# EAGLE design Adafruit 1.54in eInk Breakout (EAGLE 9.0.1)
COMPANY: ADAFRUIT INDUSTRIES; DRAWN: K. TOWNSEND; REV: A
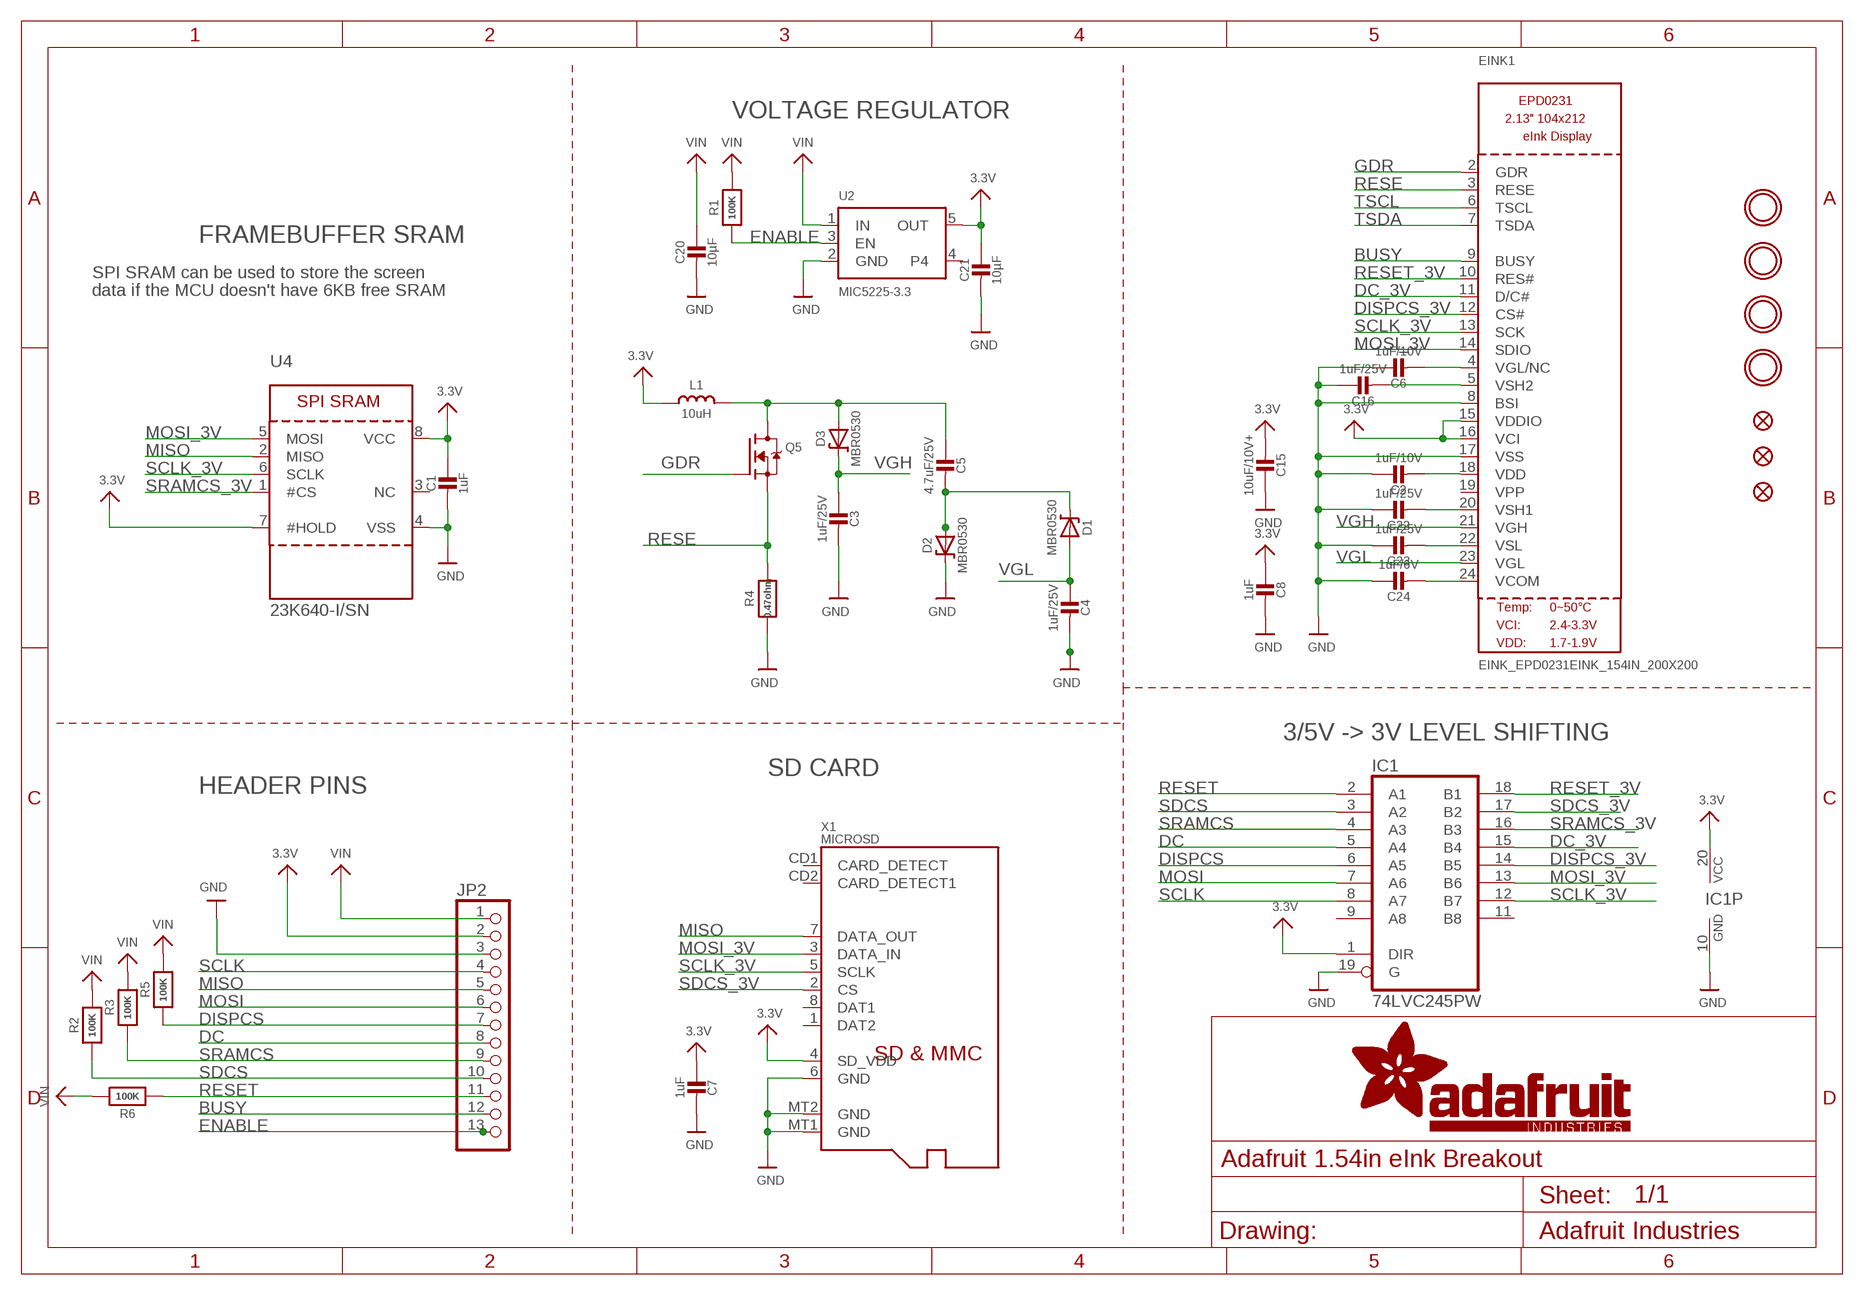
[diagram p0: schematic, sheet 1]

## Parts
C1  1uF  CAP_CERAMIC0805_10MGAP  [0805_10MGAP]
C2  1uF/10V  CAP_CERAMIC0805-NOOUTLINE  [0805-NO]
C3  1uF/25V  CAP_CERAMIC0805-NOOUTLINE  [0805-NO]
C4  1uF/25V  CAP_CERAMIC0805-NOOUTLINE  [0805-NO]
C5  4.7uF/25V  CAP_CERAMIC0805-NOOUTLINE  [0805-NO]
C6  1uF/10V  CAP_CERAMIC0805-NOOUTLINE  [0805-NO]
C7  1uF  CAP_CERAMIC0805-NOOUTLINE  [0805-NO]
C8  1uF  CAP_CERAMIC0805-NOOUTLINE  [0805-NO]
C15  10uF/10V+  CAP_CERAMIC0805-NOOUTLINE  [0805-NO]
C16  1uF/25V  CAP_CERAMIC0805-NOOUTLINE  [0805-NO]
C20  10µF  CAP_CERAMIC0805-NOOUTLINE  [0805-NO]
C21  10µF  CAP_CERAMIC0805-NOOUTLINE  [0805-NO]
C22  1uF/25V  CAP_CERAMIC0805-NOOUTLINE  [0805-NO]
C23  1uF/25V  CAP_CERAMIC0805-NOOUTLINE  [0805-NO]
C24  1uF/6V  CAP_CERAMIC0805-NOOUTLINE  [0805-NO]
D1  MBR0530  DIODE-SCHOTTKYSOD-123  [SOD-123]
D2  MBR0530  DIODE-SCHOTTKYSOD-123  [SOD-123]
D3  MBR0530  DIODE-SCHOTTKYSOD-123  [SOD-123]
EINK1  EINK_EPD0231EINK_154IN_200X200  [EINK_154IN]
FID1  FIDUCIAL_1MM  [FIDUCIAL_1MM]
FID2  FIDUCIAL_1MM  [FIDUCIAL_1MM]
FID3  FIDUCIAL_1MM  [FIDUCIAL_1MM]
IC1  74LVC245PW  74245TSSOP20  [TSSOP20]
JP2  HEADER-1X13  [1X13_ROUND_70]
L1  10uH  INDUCTORNR401  [INDUCTOR_4X4MM_NR401]
Q5  IRLML0100  IRLML2060TRPBF  [SOT23-3]
R1  100K  RESISTOR0805_NOOUTLINE  [0805-NO]
R2  100K  RESISTOR0805_NOOUTLINE  [0805-NO]
R3  100K  RESISTOR0805_NOOUTLINE  [0805-NO]
R4  0.47ohm  RESISTOR0805_10MGAP  [0805_10MGAP]
R5  100K  RESISTOR0805_NOOUTLINE  [0805-NO]
R6  100K  RESISTOR0805_NOOUTLINE  [0805-NO]
U2  MIC5225-3.3  VREG_SOT23-5  [SOT23-5]
U4  23K640-I/SN  SRAM_SPI_SOIC8  [SOIC8_150MIL]
U$3  MOUNTINGHOLE2.5  [MOUNTINGHOLE_2.5_PLATED]
U$4  MOUNTINGHOLE2.5  [MOUNTINGHOLE_2.5_PLATED]
U$5  MOUNTINGHOLE2.5  [MOUNTINGHOLE_2.5_PLATED]
U$6  MOUNTINGHOLE2.5  [MOUNTINGHOLE_2.5_PLATED]
X1  MICROSD  [MICROSD]

## Nets
3.3V: C1.1 C7.1 C8.1 C15.2 C21.1 EINK1.15(VDDIO) EINK1.16(VCI) IC1.1(DIR) IC1.20(VCC) JP2.2 L1.P$2 U2.5(OUT) U4.7(#HOLD) U4.8(VCC) X1.4(SD_VDD)
BUSY: EINK1.9(BUSY) JP2.12
DC: IC1.5(A4) JP2.8
DC_3V: EINK1.11(D/C#) IC1.15(B4)
DISPCS: IC1.6(A5) JP2.7 R5.1
DISPCS_3V: EINK1.12(CS#) IC1.14(B5)
ENABLE: JP2.13 R1.1 U2.3(EN)
GDR: EINK1.2(GDR) Q5.1(G)
GND: C1.2 C2.1 C3.2 C4.2 C6.1 C7.2 C8.2 C15.1 C16.1 C20.2 C21.2 C22.1 C23.1 C24.1 D2.C EINK1.8(BSI) EINK1.17(VSS) IC1.10(GND) IC1.19(G) JP2.3 R4.2 U2.2(GND) U4.4(VSS) X1.6(GND) X1.MT1(GND) X1.MT2(GND)
MISO: JP2.5 U4.2(MISO) X1.7(DATA_OUT)
MOSI: IC1.7(A6) JP2.6
MOSI_3V: EINK1.14(SDIO) IC1.13(B6) U4.5(MOSI) X1.3(DATA_IN)
N$2: C5.2 D1.C D2.A
N$3: C5.1 D3.A L1.P$1 Q5.3(D)
N$4: C16.2 EINK1.5(VSH2)
N$5: C2.2 EINK1.18(VDD)
N$6: C22.2 EINK1.20(VSH1)
N$9: C6.2 EINK1.4(VGL/NC)
N$27: C23.2 EINK1.22(VSL)
N$33: C24.2 EINK1.24(VCOM)
RESE: EINK1.3(RESE) Q5.2(S) R4.1
RESET: IC1.2(A1) JP2.11 R6.1
RESET_3V: EINK1.10(RES#) IC1.18(B1)
SCLK: IC1.8(A7) JP2.4
SCLK_3V: EINK1.13(SCK) IC1.12(B7) U4.6(SCLK) X1.5(SCLK)
SDCS: IC1.3(A2) JP2.10 R2.1
SDCS_3V: IC1.17(B2) X1.2(CS)
SRAMCS: IC1.4(A3) JP2.9 R3.1
SRAMCS_3V: IC1.16(B3) U4.1(#CS)
TSCL: EINK1.6(TSCL)
TSDA: EINK1.7(TSDA)
VGH: C3.1 D3.C EINK1.21(VGH)
VGL: C4.1 D1.A EINK1.23(VGL)
VIN: C20.1 JP2.1 R1.2 R2.2 R3.2 R5.2 R6.2 U2.1(IN)
Unconnected: EINK1.19(VPP) IC1.9(A8) IC1.11(B8) U2.4 U4.3(NC) X1.1(DAT2) X1.8(DAT1) X1.CD1(CARD_DETECT) X1.CD2(CARD_DETECT1)

## Notes on the sheet
- VOLTAGE REGULATOR
- FRAMEBUFFER SRAM
- SPI SRAM can be used to store the screen
- data if the MCU doesn't have 6KB free SRAM
- 3/5V -> 3V LEVEL SHIFTING
- SD CARD
- HEADER PINS

## Library data of the parts
C1-C8 C15 C16 C20-C24 = microbuilder:CAP_CERAMIC: Ceramic Capacitors For new designs, use the packages preceded by an '_' character since they are more reliable: The following footprints should be used on most boards: _0402 - Standard footprint for regular board layouts _0603 - Standard footprint for regular board layouts _0805 - Standard footprint for regular board layouts _1206 - Standard footprint for regular board layouts For extremely tight-pitch boards where space is at a premium, the following 'micro-pitch' footprints can be used (smaller pads, no silkscreen outline, etc.): _0402MP - Micro-pitch footprint for very dense/compact boards _0603MP - Micro-pitch footprint for very dense/compact boards _0805MP - Micro-pitch footprint for very dense/compact boards _1206MP - Micro-pitch footprint for very dense/compact boards
D1-D3 = microbuilder:DIODE-SCHOTTKY
EINK1 = microbuilder:EINK_EPD0231
FID1-FID3 = microbuilder:FIDUCIAL: Fiducial Alignment Points Various fiducial points for machine vision alignment.; BOM: EXCLUDE
IC1 = microbuilder:74*245: Octal BUS TRANSCEIVER, 3-state
JP2 = microbuilder:HEADER-1X13
L1 = microbuilder:INDUCTOR: Inductors 0603: 10nH Ceramic Inductor - microwire antenna/RF (Digikey: 712-1434-2-ND) 0805: 560nH Ceramic Inductor - RF (Digikey: 553-1047-1-ND) 270nH Ceramic Inductor - Q = 40@250MHz, +-5%, 1 Ohm DC Resistance (Digikey: 535-10506-2-ND) 1007 (2518 Metric) SMT: 10µH 10% 250mOhm 820mA 1007 Inductor (Digikey: 587-2189-1-ND) 22µH 10% 500mOhm 580mA 1007 Inductor (Digikey: 587-2190-1-ND) 47µH 10% 950mOhm 420mA 1007 Inductor (Digikey: 587-2191-1-ND) 47µH 5% 100mOhm 1A 1008 Inductor (Digikey: 732-1816-1-ND) 5.0x5.0mm (Taiyo Yuden NR5040 Series) 6.8µH 20% 2.3A 64mOhm Inductor (Digikey: 587-2374-2-ND) 5.0x5.0mm (TDK VLC5045 Series) 4.7µH 20% 3.3A 34mOhm Inductor (Digikey: 445-6526-1-ND) 6.8µH 20% 2.7A 46mOhm Inductor (Digikey: 445-6527-1-ND) 6.0x6.0mm (TDK VLC6045 Series) 4.7µH 20% 3.8A 27mOhm Inductor (Digikey: 445-6538-2-ND) 6.8µH 20% 3A 41mOhm Inductor (Digikey: 445-6540-1-ND) 6.2µH 30% 2.2A 45mOhm Inductor (Digikey: SRR5028-6R2YCT-ND) - Not TDK VLC6045 but footprint should match 6.0x6.0mm (TDK SLF6045 Series) 6.8uH 30% 2A 33mOhm Inductor (Digikey: 445-4572-1-ND, Mouser: 810-SLF645T6R8N2R0PF) 6.0x6.0mm (Sumida CDRH5D28 Series) 6.2uH 30% 1.8A 45mOhm Inductor (Digikey: 308-1542-1-ND) Taiyo Yuden NR3015T2R2M - 2.2uH 20% 1.5A (Digikey: 587-1648-2-ND, Mouser: 963-NR3015T2R2M) - Used with TI TPS62172 CoilCraft RFID Transponder Coil - MA5532-AE (For use with AS3935 Lightning Sensor) Taiyo Yuden NRH2412T2R2MNGH - 2.2uH 20% 1AA (Digikey: 587-3443-1-ND) - Used with TI LM3671 Vishay IHLP 1.0uH Molded Inductor - 24mOhm DCR, 5A, +/-20%, -55°C-125°C (Digikey: 541-1319-1-ND)
Q5 = Parts:IRLML2060TRPBF
R1-R6 = microbuilder:RESISTOR: Resistors For new designs, use the packages preceded by an '_' character since they are more reliable: The following footprints should be used on most boards: _0402 - Standard footprint for regular board layouts _0603 - Standard footprint for regular board layouts _0805 - Standard footprint for regular board layouts _1206 - Standard footprint for regular board layouts For extremely tight-pitch boards where space is at a premium, the following 'micro-pitch' footprints can be used (smaller pads, no silkscreen outline, etc.): _0402MP - Micro-pitch footprint for very dense/compact boards _0603MP - Micro-pitch footprint for very dense/compact boards _0805MP - Micro-pitch footprint for very dense/compact boards _1206MP - Micro-pitch footprint for very dense/compact boards
U2 = microbuilder:VREG_SOT23-5: SOT23-5 Fixed Voltage Regulators Part Current Out V Out V In V Dropout θJA (°C/W) TJ (°C) Digikey Part No. ADP121 150mA 3.3V 3.4-5.5V 0.09V @ 150mA -- -- ADP121-AUJZ33R7CT-ND ADP121 150mA 3.0V 3.1-5.5V 0.09V @ 150mA -- -- ADP121-AUJZ30R7CT-ND ADP122 300mA 3.3V 3.4-5.5V 0.085V @ 300mA -- -- ADP122AUJZ-3.3-R7CT-ND ADP1712 300mA 3.3V 3.5-5.5V 0.17V @ 300mA -- -- ADP1712AUJZ-3.3-R7TR-ND AP7311 (Low Cost) 150mA 3.3V 3.5-6V 0.15V @ 150mA -- -- AP7311-33WG-7DICT-ND LD39015M18R 150mA 1.8V 1.9V-5.5V 0.08V @ 100mA -- -- 497-6977-1-ND LP2985A-33DBVR 150mA 3.3V 3.3-16V 0.28V @ 150mA 206 150 296-18479-1-ND MCP1824T-3302E/OT 300mA 3.3V 3.5V-6V 0.2V @ 300mA -- -- MCP1824T-3302E/OTCT-ND MIC5205-2.5YM5 TR 150mA 2.5V 2.7-16V 0.165V @ 150mA -- -- 576-1257-2-ND MIC5205-3.0YM5 TR 150mA 3.0V 3.2V-16V 0.165V @ 150mA -- -- 576-1258-2-ND MIC5205-3.3YM5 TR 150mA 3.3V 3.5V-16V 0.165V @ 150mA -- -- 576-1259-2-ND TPS780330220 150mA 3.3V+2.2V 3.6-5.5V 250mV Max -- -- 296-23332-1-ND TDA3663/N1,135 100mA 3.3V 3.5-45V 0.18V @ 50mA -- -- 568-5343-1-ND Max operating temp can be calculated using θJA, TJ (max junction temperature), and power in watts. Set the "Maximum Ambient Temperature" until it reaches TJ ("Max Junction Temperature"), which is the absolute limit for safe use of the regulator: Heat Sink Temperature Calculator <http://www.daycounter.com/Calculators/Heat-Sink-Temperature-Calculator.phtml> For example, With 12V source into a 3.3V LP2985 and a 30mA load, we are dissipating (12V-3.3V) * 0.03A = 0.261W. With a θJA of 206 °C/W, a TJ of 150°C, and 261mW we can safely use the chip without a heat sink up to 75°C (=147.1°C Junction Temperature).
U4 = microbuilder:SRAM_SPI_SOIC8: SRAM - 8-Pin SPI Interface 23K640-I/SN - 8KB (64Kb), 20MHz, 2.7-3.6V 23K256-I/SN - 32KB (256Kb), 20MHz, 2.7-3.6V 23LC512-I/SN - 64KB (512Kb), 20MHz, 2.7-3.6V
U$3-U$6 = microbuilder:MOUNTINGHOLE: Mounting Hole For #2 screws (0.086"/2.18mm width, 0.094"/2.4mm hole) use 2.5mm; BOM: EXCLUDE
X1 = microbuilder:MICROSD: MicroSD/Transflash Card Holder with SPI pinout 3M: 2908-05WB-MG 4UConnector: 19656 Footprint courtesy: Adafruit Industries

## Board
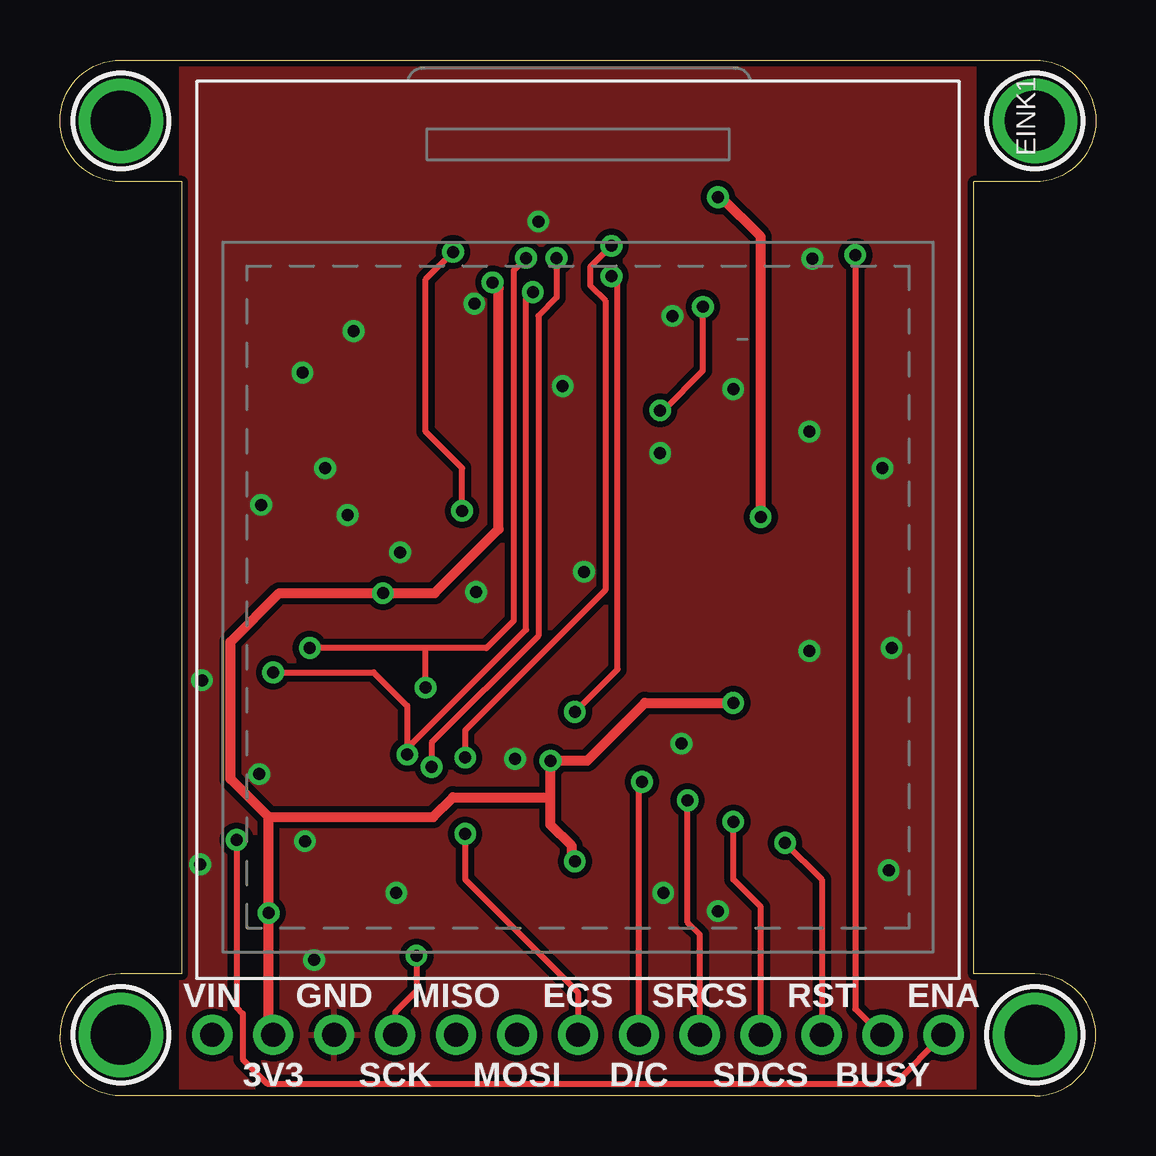
[diagram p1: board, top side]
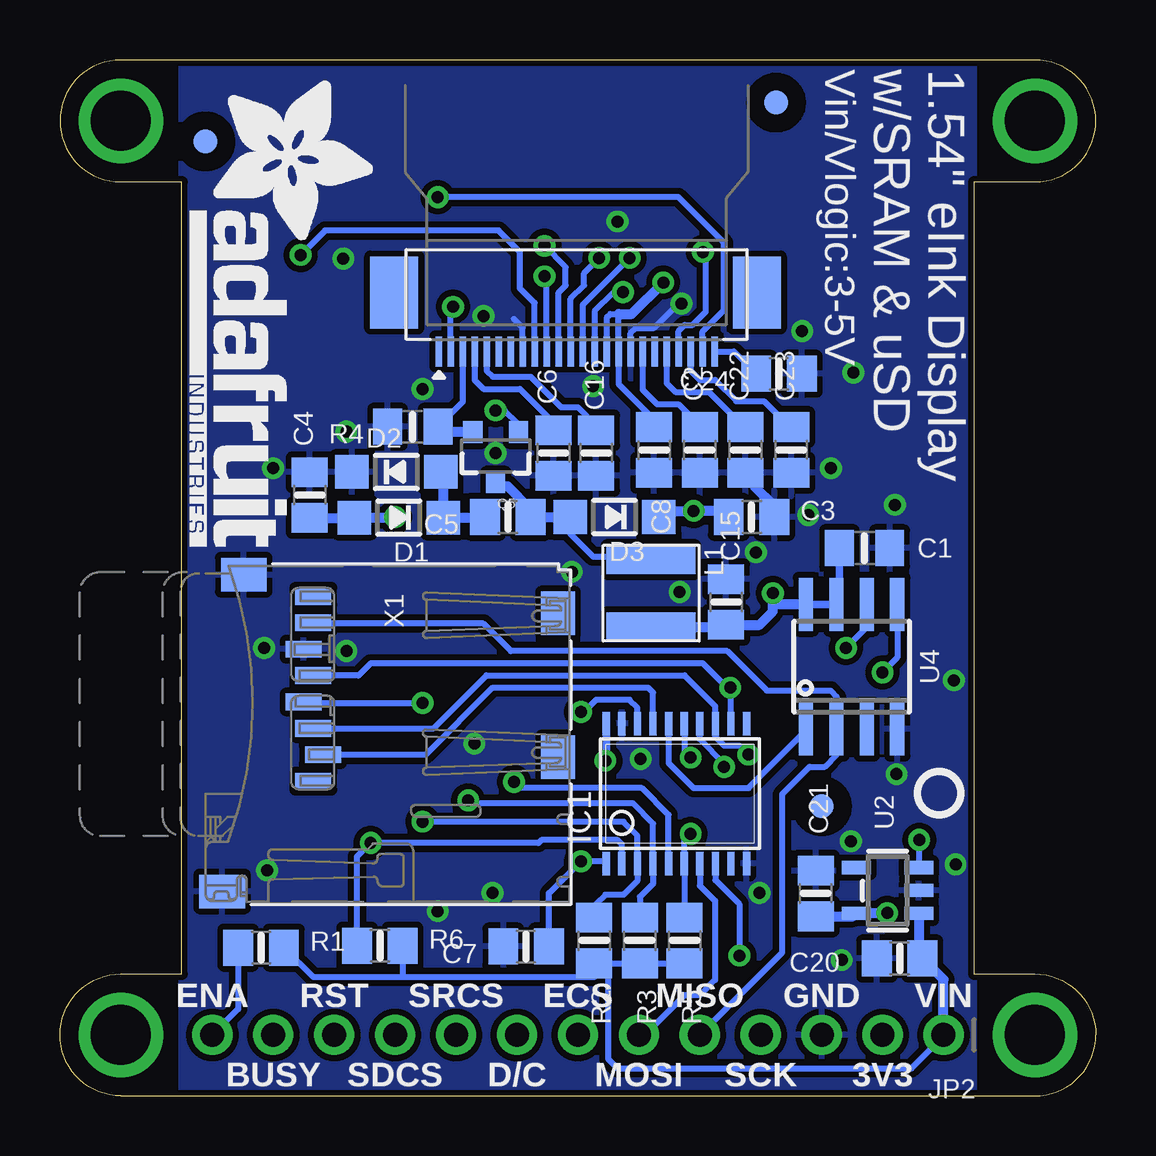
[diagram p2: board, bottom side, seen from below]

Size 43.18 x 43.18 mm. Coordinates in mm from the lower left corner, seen from the top.
Outline: 40.64,0 2.54,0 arc-90 0,2.54 arc-90 2.54,5.08 5.08,5.08 5.08,38.1 2.54,38.1 arc-90 0,40.64 arc-90 2.54,43.18 40.64,43.18 arc-90 43.18,40.64 arc-90 40.64,38.1 38.1,38.1 38.1,5.08 40.64,5.08 arc-90 43.18,2.54 arc-90 40.64,0
Copper layers (1*16): Top 0.035mm / dielectric 1.5mm / Bottom 0.035mm
Design rules "adafruit *": minimum track width 8mil, minimum drill 15.5mil, track to track 8mil, track to pad 8mil, pad to pad 8mil, via to via 8mil, smd to smd 8mil, copper to edge 10mil, drill to drill 8mil, minimum pad ring 10mil, minimum via ring 8mil, stop-mask expansion 2mil, vias tented up to drill 20mil, thermal gap 10mil

### Footprints (pad centres in the part's own frame; a part is rotated, then mirrored left to right if it is on the bottom)
0805_10MGAP = smd 1.2 x 1.5: 1 -1.05,0; 2 1.05,0
0805-NO = smd 1.24 x 1.5: 1 -0.95,0; 2 0.95,0
SOD-123 = smd 1.4 x 1.4: A 1.85,0; C -1.85,0
EINK_154IN = smd 1.25 x 0.275 bottom: 1 3.56,-8; 2 3.56,-8.5; 3 3.56,-9; 4 3.56,-9.5; 5 3.56,-10; 6 3.56,-10.5; 7 3.56,-11; 8 3.56,-11.5; 9 3.56,-12; 10 3.56,-12.5; 11 3.56,-13; 12 3.56,-13.5; 13 3.56,-14; 14 3.56,-14.5; 15 3.56,-15; 16 3.56,-15.5; 17 3.56,-16; 18 3.56,-16.5; 19 3.56,-17; 20 3.56,-17.5; 21 3.56,-18; 22 3.56,-18.5; 23 3.56,-19; 24 3.56,-19.5 | smd 3 x 2 bottom: SPRT1 1.1,-6.15; SPRT2 1.1,-21.26
FIDUCIAL_1MM = smd 1 x 1: 1 0,0
TSSOP20 = smd 0.305 x 0.991: 1 -3.075,-2.918; 2 -2.425,-2.918; 3 -1.775,-2.918; 4 -1.125,-2.918; 5 -0.475,-2.918; 6 0.175,-2.918; 7 0.825,-2.918; 8 1.475,-2.918; 9 2.125,-2.918; 10 2.775,-2.918; 11 2.775,2.918; 12 2.125,2.918; 13 1.475,2.918; 14 0.825,2.918; 15 0.175,2.918; 16 -0.475,2.918; 17 -1.125,2.918; 18 -1.775,2.918; 19 -2.425,2.918; 20 -3.075,2.918
1X13_ROUND_70 = drill 1 pad 1.676: 1 -15.24,0; 2 -12.7,0; 3 -10.16,0; 4 -7.62,0; 5 -5.08,0; 6 -2.54,0; 7 0,0; 8 2.54,0; 9 5.08,0; 10 7.62,0; 11 10.16,0; 12 12.7,0; 13 15.24,0
INDUCTOR_4X4MM_NR401 = smd 1.2 x 3.7: P$1 -1.4,0; P$2 1.4,0
SOT23-3 = smd 0.8 x 0.9: 1 -0.95,-1; 2 0.95,-1; 3 0,1.1
SOT23-5 = smd 0.55 x 1.2: 1 -0.95,-1.3; 2 0,-1.3; 3 0.95,-1.3; 4 0.95,1.3; 5 -0.95,1.3
SOIC8_150MIL = smd 0.6 x 2.2: 1 -1.905,-2.6; 2 -0.635,-2.6; 3 0.635,-2.6; 4 1.905,-2.6; 5 1.905,2.6; 6 0.635,2.6; 7 -0.635,2.6; 8 -1.905,2.6
MOUNTINGHOLE_2.5_PLATED = drill 2.5 pad 3.2: P$1 0,0
MICROSD = smd 0.7 x 1.5: 1 9,-10.64; 2 7.9,-10.24; 3 6.8,-10.64; 4 5.7,-11.04; 5 4.6,-10.64; 6 3.5,-11.04; 7 2.4,-10.64; 8 1.3,-10.64 | smd 1.8 x 1.4: CD1 2,-0.44; CD2 8,-0.44 | smd 1.4 x 1.9: MT1 0.4,-13.54; MT2 13.6,-14.44

### Placement (x,y rotation side)
C1  9.64,22.83 0 bottom
C2  16.51,26.92 90 bottom
C3  14.35,24.13 0 bottom
C4  32.77,25.04 90 bottom
C5  24.51,24.13 180 bottom
C6  22.61,26.8 90 bottom
C7  23.75,6.22 180 bottom
C8  18.41,26.92 270 bottom
C15  15.41,20.59 270 bottom
C16  20.83,26.8 90 bottom
C20  8.18,5.73 180 bottom
C21  11.67,8.43 90 bottom
C22  14.61,26.92 90 bottom
C23  12.7,26.92 90 bottom
C24  13.21,30.1 180 bottom
D1  29.06,24.1 180 bottom
D2  29.16,26.01 0 bottom
D3  20.07,24.13 180 bottom
EINK1  35.39,34.59 270 top
FID1  37.12,39.78 0 bottom
FID2  11.42,12.08 90 bottom
FID3  13.34,41.4 0 bottom
IC1  17.33,12.6 0 bottom
JP2  21.59,2.54 180 bottom
L1  18.54,20.95 270 bottom
Q5  25.02,26.67 180 bottom
R1  34.8,6.18 0 bottom
R2  20.92,6.48 270 bottom
R3  19.01,6.48 270 bottom
R4  28.47,27.89 180 bottom
R5  17.14,6.48 270 bottom
R6  29.85,6.26 0 bottom
U2  8.68,8.56 90 bottom
U4  10.18,17.89 0 bottom
U$3  2.54,2.54 0 top
U$4  40.64,2.54 0 top
U$5  2.54,40.64 0 top
U$6  40.64,40.64 0 top
U$9  [PCBFEAT-REV-040]  6.53,12.63 0 bottom
U$28  [ADAFRUIT_TEXT_20MM]  37.76,42.47 270 bottom
X1  21.98,22.12 270 bottom

### Tracks (layer width: path | path; a pad name or v marks a point on that pad's centre or on a via)
3.3V  (via drill 0.5)
  Top 0.406: 8.7,11.62 v8.7,7.62 8.7,2.73 JP2.2 | v18.03,33.91 18.29,33.66 18.29,23.62 15.62,20.95 v13.46,20.95 9.14,20.95 7.11,18.92 7.11,13.21 8.7,11.62 | v28.07,16.38 24.38,16.38 21.97,13.97 v20.45,13.97 20.45,12.45 | 20.45,12.45 20.45,11.3 21.34,10.41 21.34,9.91 v21.46,9.78 | 8.7,11.62 15.56,11.62 16.38,12.45 20.45,12.45
  Bottom 0.254: EINK1.15 20.39,32.44 20.24,32.59 19.89,32.59 EINK1.16 19.89,29.67 18.41,28.19 C8.1 | IC1.1 20.51,9.78 v21.46,9.78 22.8,8.44 C7.1 | X1.4 33.02,16.38 v28.07,16.38
  Bottom 0.305: U4.8 U4.7 10.69,20.61 C1.1 | IC1.20 20.41,13.97 v20.45,13.97
  Bottom 0.406: 18.03,33.94 v18.03,33.91 19.35,32.59 19.89,32.59 | C21.1 10.11,7.48 U2.5 9.97,7.62 v8.7,7.62 | L1.P$2 15.5,19.55 C15.2 14.02,19.64 13.46,20.19 13.46,20.45 | 13.46,20.45 v13.46,20.95 | U4.8 13.42,20.49 13.46,20.45
BUSY  (via drill 0.5)
  Top 0.254: v33.15,35.05 33.15,3.62 34.23,2.54 JP2.12
  Bottom 0.254: EINK1.9 23.39,33.05 24,33.66 24,35.18 24.89,36.07 32.13,36.07 v33.15,35.05
DC  (via drill 0.5)
  Top 0.254: JP2.8 24.13,12.95 v24.26,13.08
  Bottom 0.254: IC1.5 17.81,11.71 18.92,12.83 24,12.83 v24.26,13.08
DC_3V  (via drill 0.5)
  Top 0.254: v22.99,35.43 22.1,34.54 22.1,33.78 22.73,33.15 22.73,21.08 16.89,15.24 v16.89,14.1
  Bottom 0.254: IC1.15 17.16,14.24 17.03,14.24 v16.89,14.1 | EINK1.11 22.39,33.49 22.1,33.78 22.1,34.54 v22.99,35.43
DISPCS  (via drill 0.5)
  Top 0.254: v16.89,10.92 16.89,9.02 21.59,4.32 JP2.7
  Bottom 0.254: v16.89,10.92 17.16,10.65 IC1.6 17.14,9.67 R5.1
DISPCS_3V  (via drill 0.5)
  Top 0.254: v15.49,13.72 15.49,14.73 19.94,19.18 19.94,32.51 20.7,33.27 v20.7,34.92
  Bottom 0.254: 21,34.62 v20.7,34.92 21.34,34.29 21.34,33.78 21.89,33.23 EINK1.12 | v15.49,13.72 15.49,13.84 16.51,14.86 IC1.14
ENABLE  (via drill 0.5)
  Top 0.254: v7.37,10.67 7.37,3.68 7.62,3.43 7.62,1.52 8.64,0.51 34.8,0.51 JP2.13
  Bottom 0.254: U2.3 7.4,9.53 7.37,9.55 v7.37,10.67 | R1.1 35.75,3.62 JP2.13
GDR  (via drill 0.5)
  Top 0.254: v26.8,32.89 26.8,30.23 25.15,28.57 v25.02,28.57
  Bottom 0.254: EINK1.2 26.89,32.8 v26.8,32.89 | Q5.1 24.07,28 24.64,28.57 v25.02,28.57
GND  (via drill 0.5)
  Bottom 0.254: EINK1.17 19.39,31.79 19.18,32 18.41,32 17.4,33.02 v17.27,33.02 | EINK1.8 23.89,32.02 24.26,32.38
  Bottom 0.406: C3.2 13.4,24.58 14.22,25.4 14.22,25.78
  other vias: 34.67,18.67 8.38,24.64 19.94,36.45 25.91,14.68 34.54,9.4 31.37,34.9 12.24,31.88 8.31,13.41 11.99,24.21 5.92,17.32 5.84,9.65 18.97,14.05 14.02,8.46 14.17,22.66 10.11,30.15 11.05,26.16 20.96,29.59 31.24,27.69 34.29,26.16 28.07,29.46 25.53,32.51 21.84,21.84 10.59,5.66 10.21,10.62 31.24,18.54 27.43,7.7 25.15,8.46 25.02,26.8 17.35,21.01
  pour Bottom (isolate 0.254): 38.1,43.18 5.08,43.18 5.08,0.13 38.1,0.13
  pour Top (isolate 0.254): 38.1,43.18 5.08,43.18 5.08,0 38.1,0
MISO
  Bottom 0.254: X1.7 31.91,19.72 31.88,19.68 25.53,19.68 24.38,18.54 15.37,18.54 13.72,16.89 11.05,16.89 10.79,16.64 arc-45 10.82,16.59 U4.2 10.82,14.28 arc-45 10.79,14.22 11.3,13.72 11.94,13.72 13.08,12.57 13.08,5.97 JP2.5
MOSI
  Bottom 0.254: IC1.7 16.51,8.76 15.88,8.13 15.88,4.83 16.51,4.19 17.14,4.19 18.8,2.54 JP2.6
MOSI_3V  (via drill 0.5)
  Top 0.254: 14.48,14.48 19.43,19.43 19.43,33.22 v19.71,33.5 | 14.48,14.48 v14.48,14.22 | v8.89,17.65 13.08,17.65 14.48,16.26 14.48,14.48
  Bottom 0.254: v14.48,14.22 14.86,14.61 15.49,14.61 15.86,14.97 IC1.13 15.86,16.24 17.14,17.53 25.4,17.53 27.61,15.32 X1.3 | EINK1.14 20.89,32.7 20.09,33.5 v19.71,33.5 | U4.5 8.28,18.27 v8.89,17.65
N$2
  Bottom 0.406: D2.A 27.21,26.01 D1.C 25.46,24.11 C5.2
N$3
  Bottom 0.254: D3.A 21.92,23.44 20.96,22.48 18.67,22.48 L1.P$1
  Bottom 0.406: 21.79,24.13 D3.A C5.1 23.56,24.45 24.51,25.4 24.85,25.4 Q5.3
N$4
  Bottom 0.254: EINK1.5 25.39,30.22 25.15,29.97 23.56,29.97 22.29,28.7 21.59,28.7 20.83,27.94 C16.2
N$5
  Bottom 0.254: EINK1.18 18.89,29.43 18.29,28.83 17.4,28.83 16.51,27.94 C2.2
N$6
  Bottom 0.254: EINK1.20 17.89,29.7 17.53,29.34 16.13,29.34 14.71,27.92 arc-45 C22.2
N$9
  Bottom 0.254: EINK1.4 25.89,29.83 25.53,29.46 24,29.46 22.61,28.07 C6.2
N$27
  Bottom 0.254: EINK1.22 16.89,30.23 16.51,29.84 15.88,29.84 14.99,28.96 13.84,28.96 12.7,27.81 C23.2
N$33
  Bottom 0.254: EINK1.24 15.09,31.03 C24.2
RESE
  Bottom 0.254: EINK1.3 26.39,28.92 27.39,27.92
  Bottom 0.406: 27.39,27.92 R4.1 27.2,27.67 Q5.2
RESET  (via drill 0.5)
  Top 0.254: v30.23,10.54 31.75,9.02 JP2.11
  Bottom 0.254: IC1.2 19.76,10.49 19.94,10.67 23.11,10.67 23.24,10.54 v30.23,10.54 30.8,9.97 R6.1
RESET_3V  (via drill 0.5)
  Top 0.254: v21.46,16 23.24,17.78 23.24,33.91 v22.99,34.16
  Bottom 0.254: EINK1.10 22.89,34.07 v22.99,34.16 | IC1.18 19.11,16.19 19.43,16.51 20.83,16.51 21.34,16 v21.46,16
SCLK  (via drill 0.5)
  Top 0.254: v14.86,5.84 14.86,4.38 13.97,3.49 JP2.4
  Bottom 0.254: IC1.8 15.86,9 14.86,8 v14.86,5.84
SCLK_3V  (via drill 0.5)
  Top 0.254: 15.24,18.67 17.78,18.67 18.92,19.81 18.92,34.42 v19.43,34.92 | 15.24,18.67 v10.41,18.67 | v15.24,17.02 15.24,18.67
  Bottom 0.254: 15.21,16.86 16.38,18.03 30.23,18.03 30.74,17.52 X1.5 | v19.43,34.92 21.39,32.96 EINK1.13 | v10.41,18.67 9.55,19.54 U4.6 | IC1.12 15.21,16.86 | 15.21,16.86 15.21,16.99 v15.24,17.02
SDCS  (via drill 0.5)
  Top 0.254: JP2.10 29.21,7.87 28.07,9.02 v28.07,11.43
  Bottom 0.254: v28.07,11.43 19.69,11.43 19.11,10.85 IC1.3 19.11,8.96 19.69,8.38 20.45,8.38 20.83,8 20.83,7.51 R2.1
SDCS_3V
  Bottom 0.254: IC1.17 18.46,16.81 18.67,17.02 25.15,17.02 27.94,14.22 X1.2
SRAMCS  (via drill 0.5)
  Top 0.254: JP2.9 26.67,6.73 26.16,7.24 v26.16,12.32
  Bottom 0.254: v26.16,12.32 26.04,12.19 19.3,12.19 18.46,11.35 IC1.4 18.46,8.85 19.01,8.29 R3.1
SRAMCS_3V
  Bottom 0.254: IC1.16 17.81,13.87 16.76,12.83 14.48,12.83 12.02,15.29 U4.1 12.07,15.27
VGH  (via drill 0.5)
  Top 0.254: v16.76,24.38 16.76,26.16 15.24,27.69 15.24,34.04 v16.38,35.18
  Bottom 0.254: v16.38,35.18 16.38,34.92 16.26,34.8 16.26,32.69 16.82,32.13 17.14,32.13 17.39,31.88 EINK1.21
  Bottom 0.406: C3.1 15.3,24.26 15.49,24.26 15.62,24.38 v16.76,24.38 17.65,24.38 17.91,24.13 D3.C
VGL  (via drill 0.5)
  Top 0.254: v27.43,37.47 27.56,37.47
  Top 0.406: v29.21,24.13 29.21,35.81 27.56,37.47
  Bottom 0.254: v27.43,37.47 17.4,37.47 15.5,35.57 15.5,32.76 16.39,31.87 EINK1.23
  Bottom 0.406: C4.1 30.92,24.09 D1.A 29.23,24.11 v29.21,24.13
VIN
  Bottom 0.254: 20.19,5.53 R2.2 20.92,4.95 28.89,4.95 | 20.19,5.53 R3.2 R5.2 | R1.2 32.62,4.95 28.89,4.95 | JP2.1 6.35,2.48 7.68,1.14 19.94,1.14 20.32,1.52 20.32,5.4 20.19,5.53 | R6.2 28.89,4.95
  Bottom 0.406: U2.1 7.38,5.88 C20.1 6.35,4.85 JP2.1

### Text on the board
tPlace: VIN | GND | MISO | ECS | SRCS | RST | ENA | 3V3 | SCK | MOSI | D/C | SDCS | BUSY
bPlace: 1.54" eInk Display / w/SRAM & uSD | Vin/Vlogic:3-5V | VIN | GND | MISO | ECS | SRCS | RST | ENA | 3V3 | SCK | MOSI | D/C | SDCS | BUSY